# EAGLE design GoGoShield (EAGLE 5.07)
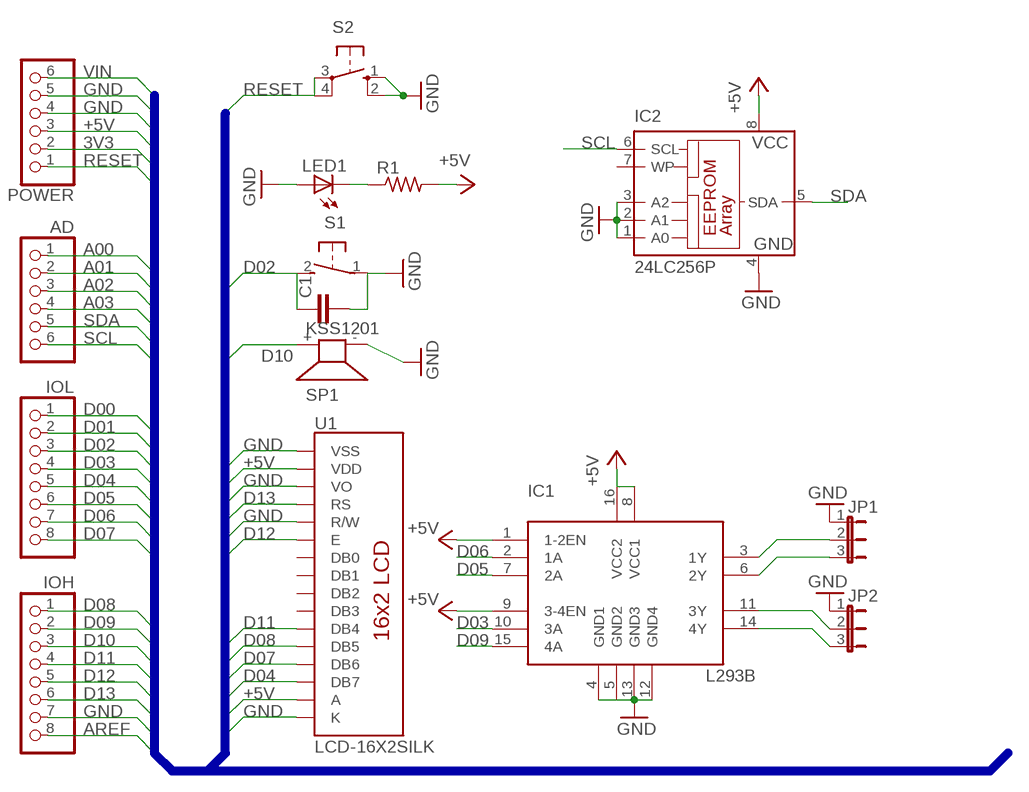
[diagram p0: schematic, sheet 1]

## Parts
AD  PINHD-1X6  [1X06]
C1  C-EU050-024X044  [C050-024X044]
IC1  L293B  [DIL16]
IC2  24LC256P  [DIL8]
IOH  PINHD-1X8  [1X08]
IOL  PINHD-1X8  [1X08]
JP1  JP2E  [JP2]
JP2  JP2E  [JP2]
LED1  LED3MM  [LED3MM]
POWER  PINHD-1X6  [1X06]
R1  R-US_0204/7  [0204/7]
S1  31-XX  [B3F-31XX]
S2  10-XX  [B3F-10XX]
SP1  KSS1201  [KSS1201]
U1  LCD-16X2SILK  [LCD-16X2]

## Nets
3V3: POWER.2
+5V: IC1.1(1-2EN) IC1.8(VCC1) IC1.9(3-4EN) IC1.16(VCC2) IC2.8(VCC) POWER.3 R1.2 U1.2(VDD) U1.15(A)
A00: AD.1
A01: AD.2
A02: AD.3
A03: AD.4
AREF: IOH.8
D00: IOL.1
D01: IOL.2
D02: C1.1 IOL.3 S1.2(S)
D03: IC1.10(3A) IOL.4
D04: IOL.5 U1.14(DB7)
D05: IC1.7(2A) IOL.6
D06: IC1.2(1A) IOL.7
D07: IOL.8 U1.13(DB6)
D08: IOH.1 U1.12(DB5)
D09: IC1.15(4A) IOH.2
D10: IOH.3 SP1.+
D11: IOH.4 U1.11(DB4)
D12: IOH.5 U1.6(E)
D13: IOH.6 U1.4(RS)
GND: C1.2 IC1.4(GND1) IC1.5(GND2) IC1.12(GND4) IC1.13(GND3) IC2.1(A0) IC2.2(A1) IC2.3(A2) IC2.4(GND) IOH.7 JP1.1 JP2.1 LED1.A POWER.4 POWER.5 S1.1(P) S2.1(S) S2.2(S1) SP1.- U1.1(VSS) U1.3(VO) U1.5(R/W) U1.16(K)
N$1: LED1.K(C) R1.1
N$3: IC1.3(1Y) JP1.2
N$4: IC1.6(2Y) JP1.3
N$5: IC1.11(3Y) JP2.2
N$6: IC1.14(4Y) JP2.3
RESET: POWER.1 S2.3(P) S2.4(P1)
SCL: AD.6 IC2.6(SCL)
SDA: AD.5 IC2.5(SDA)
VIN: POWER.6
Unconnected: IC2.7(WP) U1.7(DB0) U1.8(DB1) U1.9(DB2) U1.10(DB3)

## Buses
B$1

## Library data of the parts
AD POWER = pinhead:PINHD-1X6: PIN HEADER
C1 = rcl:C-EU: CAPACITOR, European symbol
IC1 = texas:L293B: TI DEVICE
IC2 = microchip:24*: Serial EEPROM I2C
IOH IOL = pinhead:PINHD-1X8: PIN HEADER
JP1 JP2 = jumper:JP2E: JUMPER
LED1 = led:LED: LED OSRAM: - CHIPLED LG R971, LG N971, LY N971, LG Q971, LY Q971, LO R971, LY R971 LH N974, LH R974 LS Q976, LO Q976, LY Q976 LO Q996 - Hyper CHIPLED LW Q18S LB Q993, LB Q99A, LB R99A - SideLED LS A670, LO A670, LY A670, LG A670, LP A670 LB A673, LV A673, LT A673, LW A673 LH A674 LY A675 LS A676, LA A676, LO A676, LY A676, LW A676 LS A679, LY A679, LG A679 - Hyper Micro SIDELED® LS Y876, LA Y876, LO Y876, LY Y876 LT Y87S - SmartLED LW L88C, LW L88S LB L89C, LB L89S, LG L890 LS L89K, LO L89K, LY L89K LS L896, LA L896, LO L896, LY L896 - TOPLED LS T670, LO T670, LY T670, LG T670, LP T670 LSG T670, LSP T670, LSY T670, LOP T670, LYG T670 LG T671, LOG T671, LSG T671 LB T673, LV T673, LT T673, LW T673 LH T674 LS T676, LA T676, LO T676, LY T676, LB T676, LH T676, LSB T676, LW T676 LB T67C, LV T67C, LT T67C, LS T67K, LO T67K, LY T67K, LW E67C LS E67B, LA E67B, LO E67B, LY E67B, LB E67C, LV E67C, LT E67C LW T67C LS T679, LY T679, LG T679 LS T770, LO T770, LY T770, LG T770, LP T770 LB T773, LV T773, LT T773, LW T773 LH T774 LS E675, LA E675, LY E675, LS T675 LS T776, LA T776, LO T776, LY T776, LB T776 LHGB T686 LT T68C, LB T68C - Hyper Mini TOPLED® LB M676 - Mini TOPLED Santana® LG M470 LS M47K, LO M47K, LY M47K Source: http://www.osram.convergy.de LUXEON: - LUMILED® LXK2-PW12-R00, LXK2-PW12-S00, LXK2-PW14-U00, LXK2-PW14-V00 LXK2-PM12-R00, LXK2-PM12-S00, LXK2-PM14-U00 LXK2-PE12-Q00, LXK2-PE12-R00, LXK2-PE12-S00, LXK2-PE14-T00, LXK2-PE14-U00 LXK2-PB12-K00, LXK2-PB12-L00, LXK2-PB12-M00, LXK2-PB14-N00, LXK2-PB14-P00, LXK2-PB14-Q00 LXK2-PR12-L00, LXK2-PR12-M00, LXK2-PR14-Q00, LXK2-PR14-R00 LXK2-PD12-Q00, LXK2-PD12-R00, LXK2-PD12-S00 LXK2-PH12-R00, LXK2-PH12-S00 LXK2-PL12-P00, LXK2-PL12-Q00, LXK2-PL12-R00 Source: www.luxeon.com KINGBRIGHT: KA-3528ASYC Source: www.kingbright.com
R1 = rcl:R-US_: RESISTOR, American symbol
S1 = switch-omron:31-XX: OMRON SWITCH
S2 = switch-omron:10-XX: OMRON SWITCH
SP1 = buzzer:KSS1201: SPEAKER Source: Schukat
U1 = SparkFun:LCD-16X2

## Net classes
0 default: width 0.152 mm, drill 0.305 mm, clearance 0.152 mm

## Board
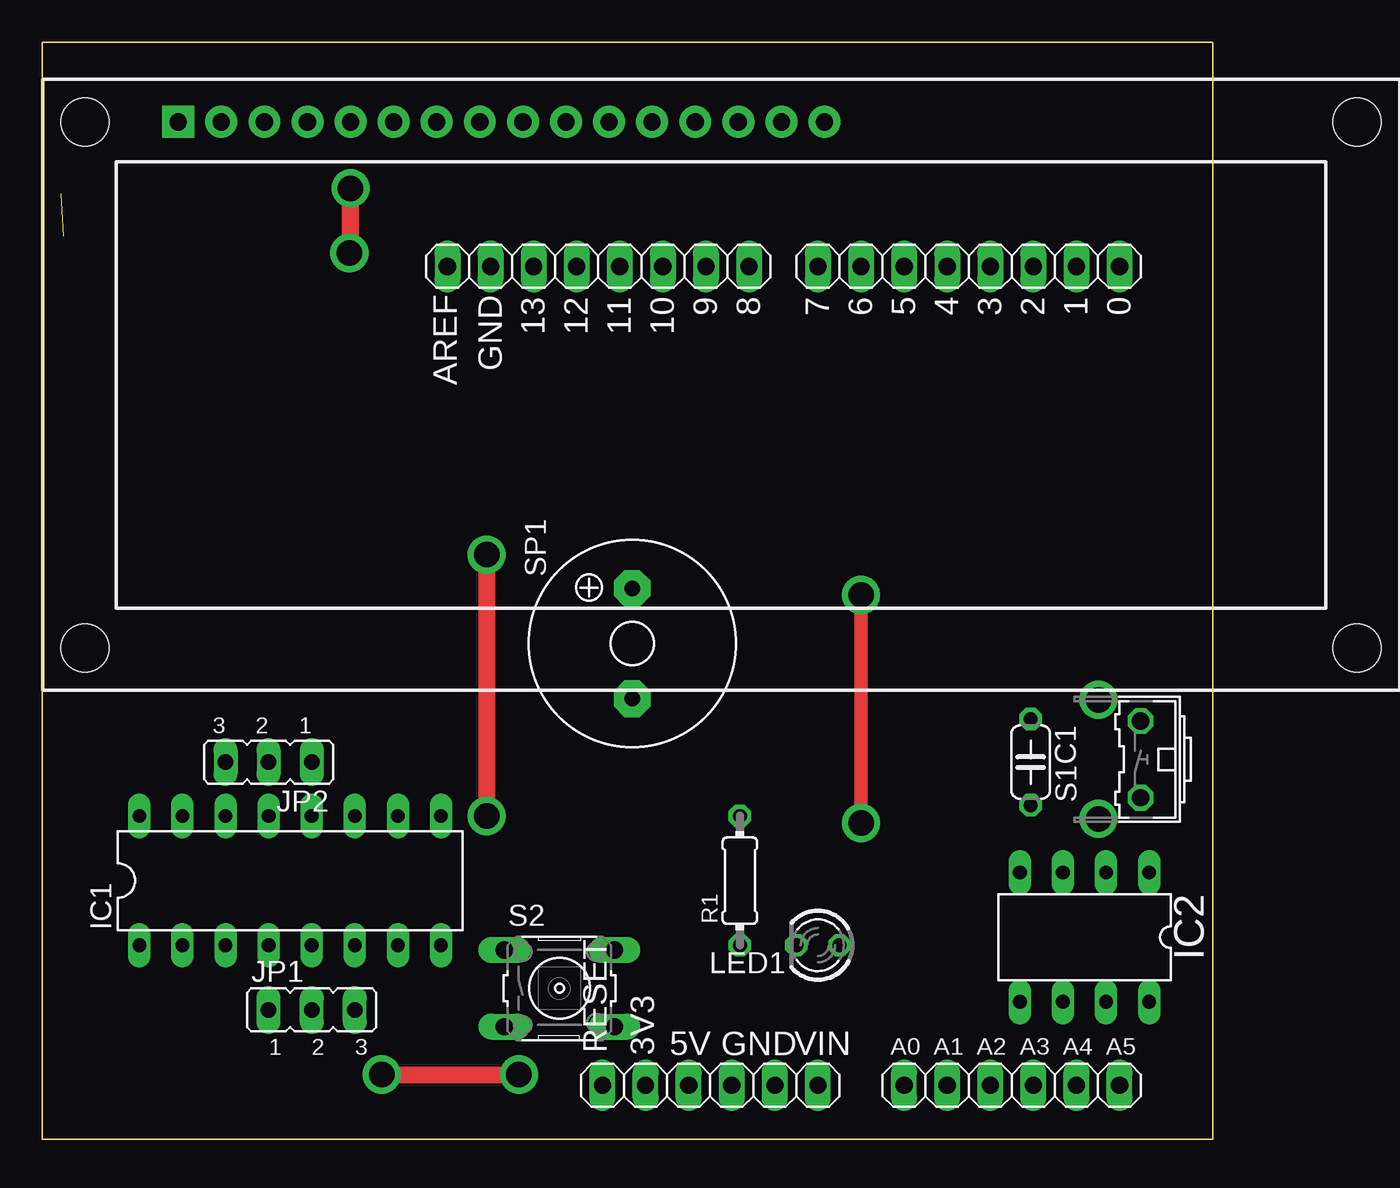
[diagram p1: board, top side]
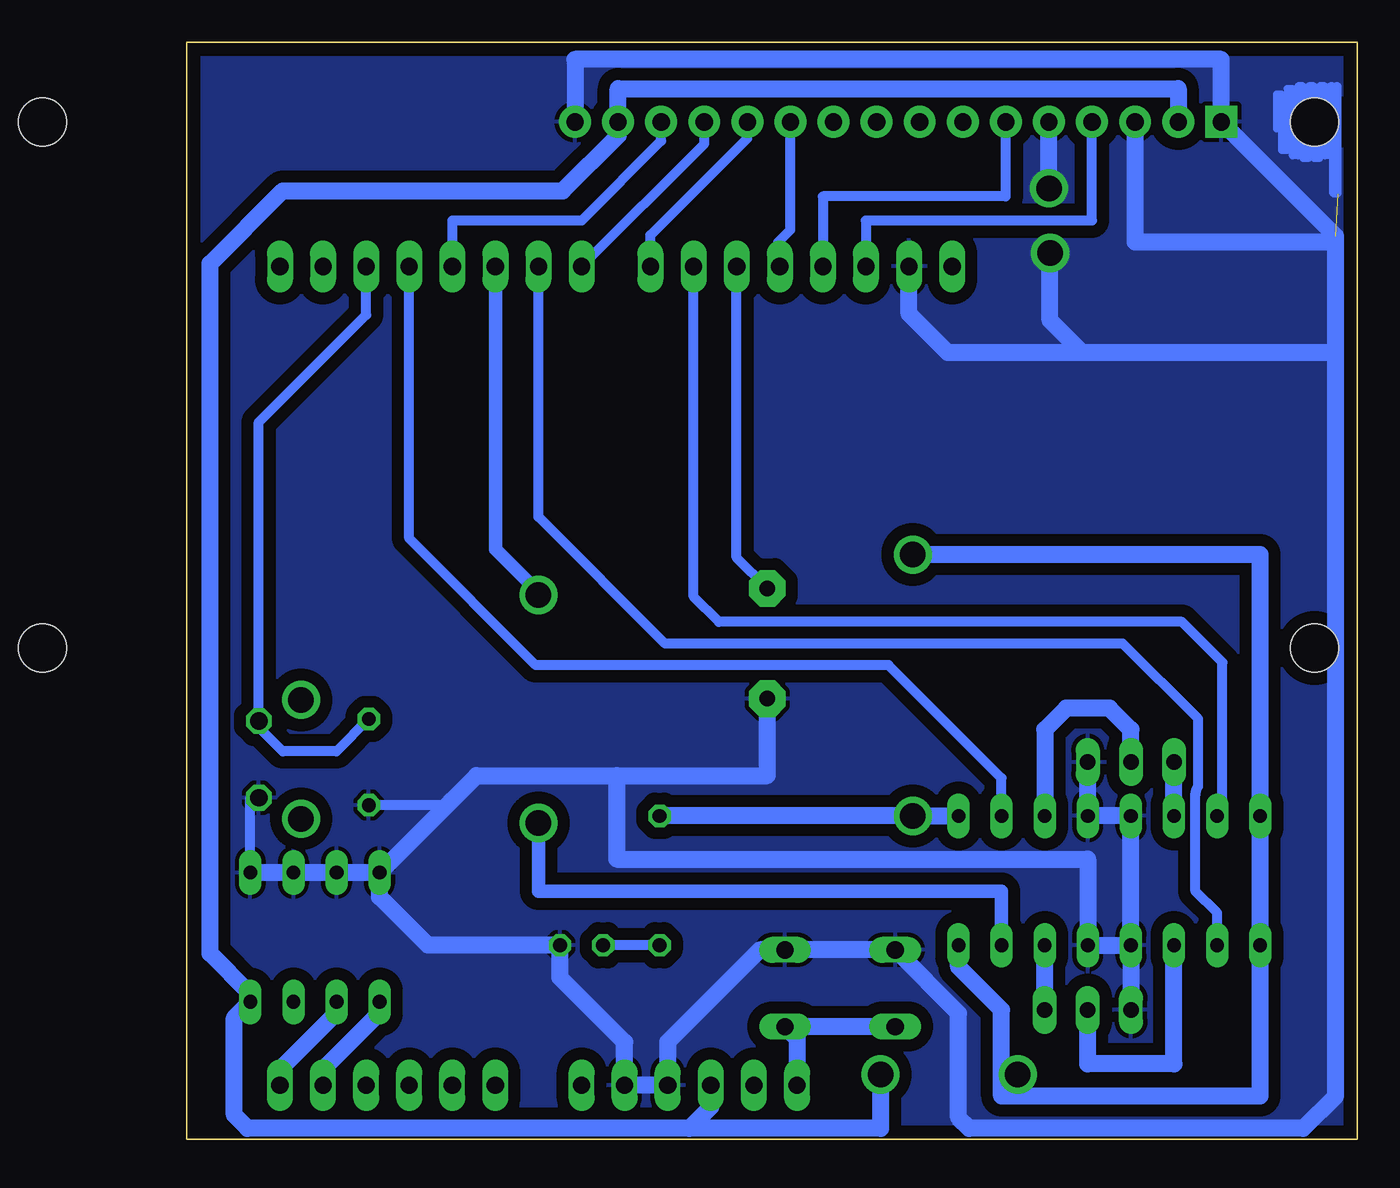
[diagram p2: board, bottom side, seen from below]

Size 69 x 64.64 mm. Coordinates in mm from the lower left corner, seen from the top.
Outline: 69,64.64 0,64.64 0,0 69,0 69,64.64
Copper layers (1*16): Top 0.035mm / dielectric 1.5mm / Bottom 0.035mm
Design rules "default *": minimum track width 26mil, minimum drill 18mil, track to track 28mil, track to pad 22mil, pad to pad 18mil, via to via 18mil, smd to smd 6mil, copper to edge 30mil, drill to drill 18mil, minimum pad ring 10mil, minimum via ring 10mil, stop-mask expansion 1mil, vias tented up to drill 0mil, thermal gap 10mil
vRestrict: area 0.6,22.5 to 2,30.7; area 5.7,23.2 to 7.4,30.7; area 47.9,10.9 to 48.5,11.4; area 50.4,10.8 to 50.9,11.7; area 11.3,29.5 to 12.7,31.8; area 0.3,13.1 to 9.4,25.1

### Footprints (pad centres in the part's own frame; a part is rotated, then mirrored left to right if it is on the bottom)
1X06 = drill 1.016 long: 1 -6.35,0; 2 -3.81,0; 3 -1.27,0; 4 1.27,0; 5 3.81,0; 6 6.35,0
C050-024X044 = drill 0.813 octagon: 1 -2.54,0; 2 2.54,0
DIL16 = drill 0.813 long: 1 -8.89,-3.81; 2 -6.35,-3.81; 3 -3.81,-3.81; 4 -1.27,-3.81; 5 1.27,-3.81; 6 3.81,-3.81; 7 6.35,-3.81; 8 8.89,-3.81; 9 8.89,3.81; 10 6.35,3.81; 11 3.81,3.81; 12 1.27,3.81; 13 -1.27,3.81; 14 -3.81,3.81; 15 -6.35,3.81; 16 -8.89,3.81
DIL8 = drill 0.813 long: 1 -3.81,-3.81; 2 -1.27,-3.81; 3 1.27,-3.81; 4 3.81,-3.81; 5 3.81,3.81; 6 1.27,3.81; 7 -1.27,3.81; 8 -3.81,3.81
1X08 = drill 1.016 long: 1 -8.89,0; 2 -6.35,0; 3 -3.81,0; 4 -1.27,0; 5 1.27,0; 6 3.81,0; 7 6.35,0; 8 8.89,0
JP2 = drill 0.914 long: 1 -2.54,0; 2 0,0; 3 2.54,0
LED3MM = drill 0.813 octagon: A -1.27,0; K 1.27,0
0204/7 = drill 0.813 octagon: 1 -3.81,0; 2 3.81,0
B3F-31XX = drill 1.016 octagon: 1 -2.261,-1.245; 2 2.261,-1.245 | drill 1.499 pad 2.159 round: 3 -3.505,1.245; 4 3.505,1.245
B3F-10XX = drill 1.016 long: 1 -3.251,2.261; 2 3.251,2.261; 3 -3.251,-2.261; 4 3.251,-2.261
KSS1201 = drill 0.914 pad 2.159 octagon: + 3.251,0; - -3.251,0
LCD-16X2 = drill 1.016 pad 1.88 square: 1 -32,15.5 | drill 1.016 pad 1.88 round: 2 -29.46,15.5; 3 -26.92,15.5; 4 -24.38,15.5; 5 -21.84,15.5; 6 -19.3,15.5; 7 -16.76,15.5; 8 -14.22,15.5; 9 -11.68,15.5; 10 -9.14,15.5; 11 -6.6,15.5; 12 -4.06,15.5; 13 -1.52,15.5; 14 1.02,15.5; 15 3.56,15.5; 16 6.1,15.5 | hole 2.8: -37.5,15.5; -37.5,-15.5; 37.5,15.5; 37.5,-15.5

### Placement (x,y rotation side)
AD  57.15,3.17 0 top
C1  58.26,22.23 270 top
IC1  14.61,15.24 0 top
IC2  61.44,11.91 180 top
IOH  32.77,51.43 180 top
IOL  54.61,51.43 180 top
JP1  15.88,7.62 0 top
JP2  13.34,22.23 180 top
LED1  45.72,11.43 180 top
POWER  39.37,3.17 0 top
R1  41.12,15.24 90 top
S1  63.5,22.38 90 top
S2  30.48,8.89 0 top
SP1  34.77,29.21 90 top
U1  40.01,44.45 0 top

### Tracks (layer width: path | path; a pad name or v marks a point on that pad's centre or on a via)
+5V  (via drill 1.5, 1.5 pad 1.93)
  Top 1: v20,3.81 v28.1,3.81 | v26.19,34.45 v26.19,19.05
  Bottom 1: IC1.8 23.5,10.16 20.95,7.62 20.95,3.65 | 39.37,0.64 38.1,1.91 POWER.3 | 39.37,0.64 65.41,0.64 66.2,1.43 66.2,7.14 IC2.8 65.25,8.57 67.63,10.95 67.63,51.59 63.34,55.88 46.83,55.88 43.56,59.15 U1.15 43.56,61.91 10.54,61.91 U1.2 10.48,59.95 | 39.37,0.64 28.1,0.64 v28.1,3.81 | 20.95,3.65 20.95,2.54 5.71,2.54 IC1.1 IC1.16 5.71,34.45 v26.19,34.45 | v20,3.81 20,3.65 20.95,3.65 | IC1.9 v26.19,19.05 R1.2
D02
  Bottom 0.6: C1.1 60.17,22.86 63.34,22.86 64.75,24.26 S1.2 64.75,42.25 58.42,48.58 IOL.3
D03
  Bottom 0.6: IOL.4 55.88,35.4 48.42,27.94 27.62,27.94 20.95,21.27 IC1.10
D04
  Bottom 0.6: IOL.5 53.34,54.13 45.72,54.13 41.02,58.83 U1.14
D05  (via drill 1.5)
  Top 0.8: v48.26,18.64 v48.26,32.07
  Bottom 0.8: IC1.7 20.95,14.61 48.26,14.61 v48.26,18.64 | IOL.6 50.8,34.77 48.26,32.23 v48.26,32.07
D06
  Bottom 0.6: IC1.2 8.26,13.33 9.53,14.61 9.53,20.32 arc37 9.37,20.8 9.37,24.77 13.81,29.21 40.8,29.21 48.26,36.67 IOL.7
D07
  Bottom 0.6: IOL.8 38.48,58.67 U1.13
D08
  Bottom 0.6: U1.12 35.95,58.99 41.66,53.28 IOH.1
D09
  Bottom 0.6: IC1.15 7.94,19.37 7.94,28.1 10.32,30.48 37.62,30.48 39.12,31.97 IOH.2
D10
  Bottom 0.6: SP1.+ 36.58,34.27 IOH.3
D11
  Bottom 0.6: U1.11 33.41,53.59 34.13,52.86 34.13,51.53 IOH.4
D12
  Bottom 0.6: U1.6 20.7,55.56 31.5,55.56 IOH.5
D13
  Bottom 0.6: U1.4 15.62,54.13 28.96,54.13 IOH.6
GND  (via drill 1.5)  (1 unrouted)
  Top 1: v18.16,56.04 18.16,52.23 v18.1,52.23
  Bottom 0.406: 1.27,62.07 1.11,62.07 1.11,55.72 1.43,55.72 1.43,62.07 1.59,62.07 1.59,57.94 1.91,57.94 1.91,62.07 2.22,62.07 2.22,57.78 2.54,57.78 2.54,62.07 2.86,62.07 2.86,57.78 3.17,57.78 3.17,62.07 3.49,62.07 3.49,57.94 3.81,57.94 3.81,61.91 4.13,61.91 4.13,58.26 4.45,58.26 4.45,61.59 4.76,61.59 4.76,59.53
  Bottom 0.6: S1.1 65.25,20.12 IC2.1 | C1.2 53.42,19.69 53.42,19.92
  Bottom 1: IC1.4 JP1.1 | IC1.4 IC1.5 15.88,16.51 43.66,16.51 43.66,21.43 | IC1.4 IC1.13 IC1.12 JP2.1 | 1.27,46.35 1.27,2.54 3.17,0.64 22.86,0.64 23.5,1.27 23.5,7.42 S2.1 S2.2 35.2,11.15 40.64,5.71 POWER.4 POWER.5 43.18,5.71 46.99,9.53 LED1.A 54.77,11.43 57.63,14.29 IC2.4 | 1.27,46.35 1.27,52.86 | 1.27,52.86 1.27,53.21 U1.1 8.01,63.63 46.1,63.63 U1.16 | IOH.7 26.42,48.64 24.13,46.35 16.19,46.35 | 1.27,46.35 16.19,46.35 | IC2.1 IC2.2 IC2.3 IC2.4 | U1.3 13.09,52.86 1.27,52.86 | v18.16,56.04 U1.5 | v18.1,52.23 18.1,48.26 16.19,46.35 | SP1.- 34.77,21.43 43.66,21.43 | 43.66,21.43 51.91,21.43 53.42,19.92 IC2.4
  pour Bottom: 0,64.64 69,64.64 69,0 0.16,0
N$1
  Bottom 0.6: R1.1 LED1.K
N$3
  Bottom 1: JP1.2 15.88,4.45 10.79,4.45 IC1.3
N$4
  Bottom 1: JP1.3 IC1.6
N$5
  Bottom 1: JP2.2 13.34,24.13 14.61,25.4 17.14,25.4 18.41,24.13 IC1.11
N$6
  Bottom 1: IC1.14 JP2.3
RESET
  Bottom 0.66: POWER.1 33,3.13
  Bottom 1: POWER.1 33.02,5.92 S2.4 S2.3
SCL
  Bottom 1: IC2.6 60.17,7.46 63.5,4.13 AD.6
SDA
  Bottom 1: IC2.5 57.63,7.46 60.96,4.13 AD.5

### Text on the board
tPlace: 13 | 12 | 11 | 10 | 9 | 8 | 7 | 6 | 5 | 4 | 3 | 2 | 1 | 0
tNames: AREF | GND | RESET | 3V3 | 5V | GND | VIN | A0 | A1 | A2 | A3 | A4 | A5
ReferenceLC: L | TX | RX | PC1 | PC2
tDocu: TM | Arduino UNO Reference Design
214bmp: D:/SmartProjects/Snc/a4_bn_logo2.bmp